# Altium project iC-LNG_MEZ.PrjPcb
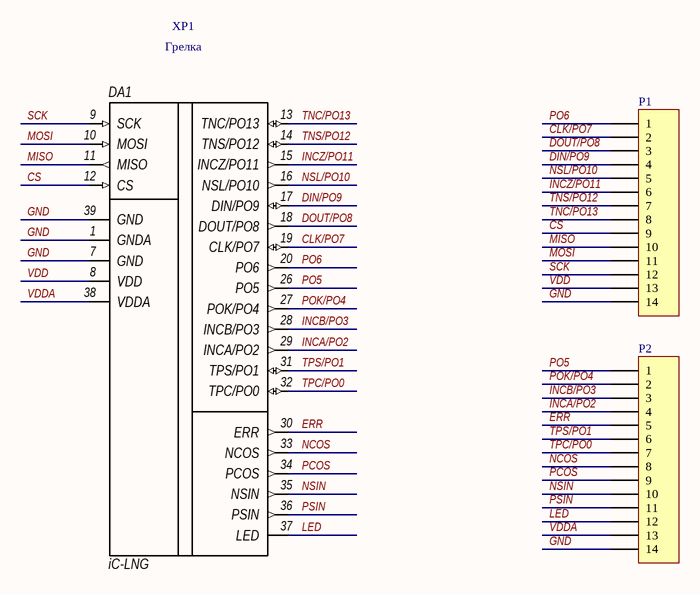
[diagram p0: MEZ_IC.SchDoc]
1 sheet, 4 parts. Net scope: global (net labels, ports and power ports of the same name join across sheets).
Board file: MEZ_IC.PcbDoc

## Sheet MEZ_IC.SchDoc
size A3; SheetNumber: 1; SheetTotal: 1

### Parts
DA1  iC-LNG  [iC-LNG oQFN]
P1  Header 14  [HDR1X14]  (value not drawn)
P2  Header 14  [HDR1X14]  (value not drawn)
XP1  Грелка  [Грелка]

### Nets
CLK/PO7: DA1.19(CLK/PO7) P1.2
CS: DA1.12(CS) P1.9
DIN/PO9: DA1.17(DIN/PO9) P1.4
DOUT/PO8: DA1.18(DOUT/PO8) P1.3
ERR: DA1.30(ERR) P2.5
GND: DA1.1(GNDA) DA1.7(GND) DA1.39(GND) P1.14 P2.14
INCA/PO2: DA1.29(INCA/PO2) P2.4
INCB/PO3: DA1.28(INCB/PO3) P2.3
INCZ/PO11: DA1.15(INCZ/PO11) P1.6
LED: DA1.37(LED) P2.12
MISO: DA1.11(MISO) P1.10
MOSI: DA1.10(MOSI) P1.11
NCOS: DA1.33(NCOS) P2.8
NSIN: DA1.35(NSIN) P2.10
NSL/PO10: DA1.16(NSL/PO10) P1.5
PCOS: DA1.34(PCOS) P2.9
PO5: DA1.26(PO5) P2.1
PO6: DA1.20(PO6) P1.1
POK/PO4: DA1.27(POK/PO4) P2.2
PSIN: DA1.36(PSIN) P2.11
SCK: DA1.9(SCK) P1.12
TNC/PO13: DA1.13(TNC/PO13) P1.8
TNS/PO12: DA1.14(TNS/PO12) P1.7
TPC/PO0: DA1.32(TPC/PO0) P2.7
TPS/PO1: DA1.31(TPS/PO1) P2.6
VDD: DA1.8(VDD) P1.13
VDDA: DA1.38(VDDA) P2.13

### Library data of the parts
DA1 = iC-LNG: Оптический энкодер
P1 P2 = Header 14: Header, 14-Pin; LatestRevisionDate: 17-Jul-2002; LatestRevisionNote: Re-released for DXP Platform.; Publisher: Altium Limited